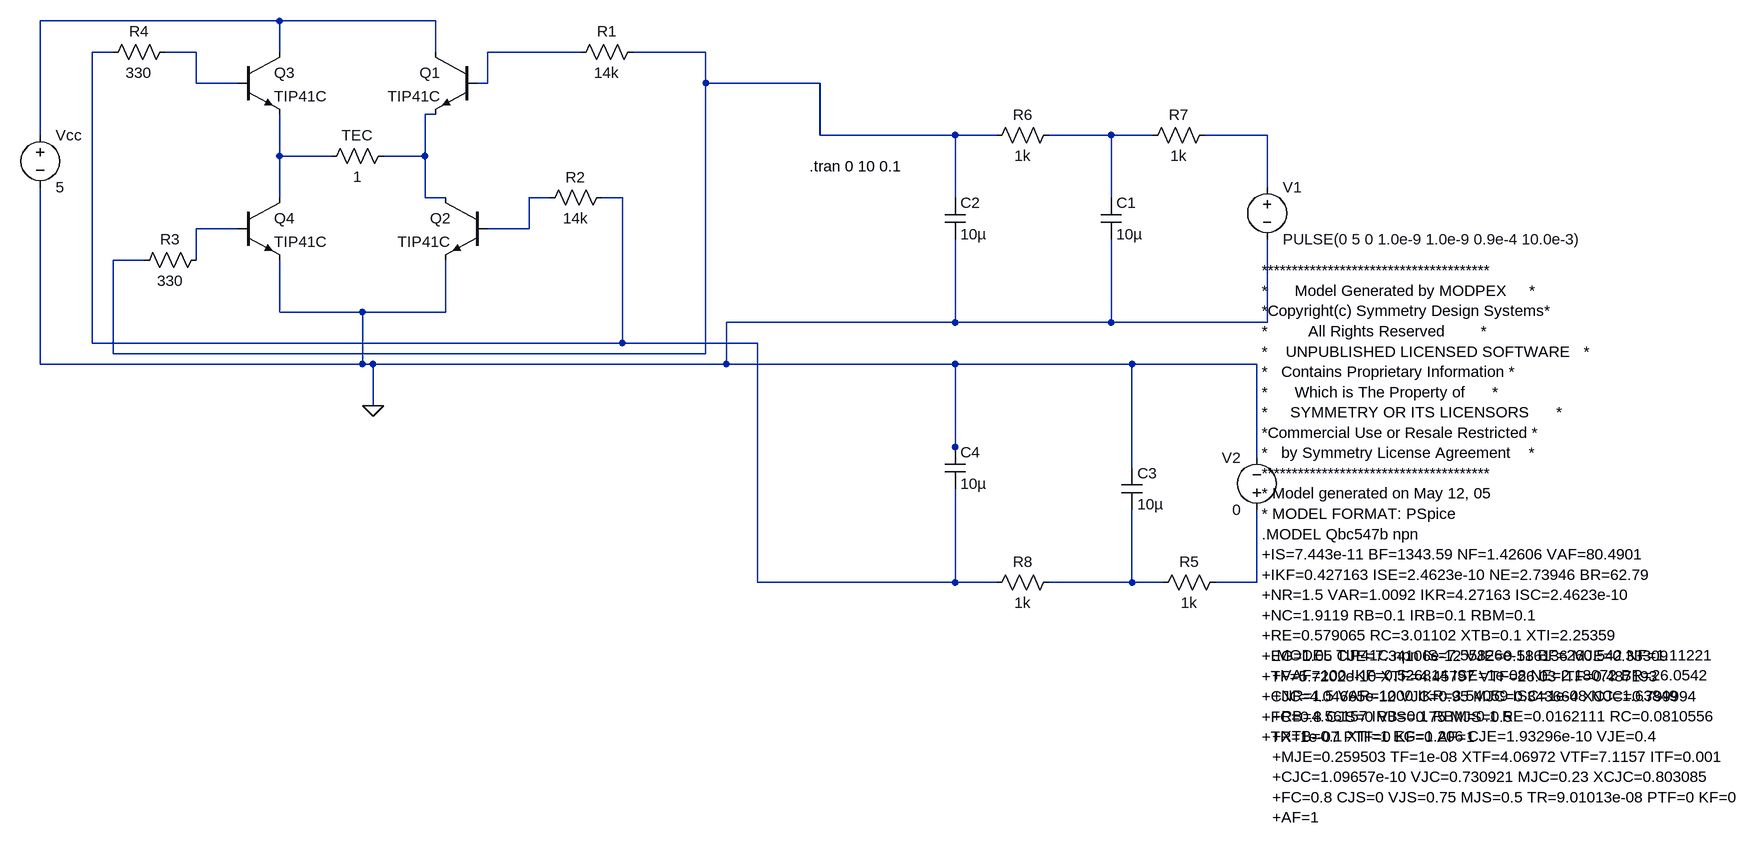
[diagram p0: schematic H-bridge-Darlington withPWM.asc]
H-bridge-Darlington withPWM.asc, the LTspice schematic file:
Version 4
SHEET 1 1956 1104
WIRE -288 -64 -656 -64
WIRE -48 -64 -288 -64
WIRE -544 -16 -576 -16
WIRE -416 -16 -464 -16
WIRE -288 -16 -288 -64
WIRE -48 -16 -48 -64
WIRE 176 -16 32 -16
WIRE 368 -16 256 -16
WIRE -416 32 -416 -16
WIRE -352 32 -416 32
WIRE 32 32 32 -16
WIRE 32 32 16 32
WIRE 368 32 368 -16
WIRE 544 32 368 32
WIRE -48 80 -64 80
WIRE -656 112 -656 -64
WIRE 544 112 544 32
WIRE 752 112 544 112
WIRE 816 112 752 112
WIRE 992 112 896 112
WIRE 1056 112 992 112
WIRE 1232 112 1136 112
WIRE -288 144 -288 80
WIRE -208 144 -288 144
WIRE -64 144 -64 80
WIRE -64 144 -128 144
WIRE 1232 192 1232 112
WIRE -288 208 -288 144
WIRE -64 208 -64 144
WIRE -32 208 -64 208
WIRE 128 208 96 208
WIRE 240 208 208 208
WIRE 752 208 752 112
WIRE 992 208 992 112
WIRE -352 256 -416 256
WIRE 96 256 96 208
WIRE 96 256 32 256
WIRE -496 304 -544 304
WIRE -416 304 -416 256
WIRE -288 384 -288 304
WIRE -160 384 -288 384
WIRE -32 384 -32 304
WIRE -32 384 -160 384
WIRE 752 400 752 272
WIRE 752 400 400 400
WIRE 992 400 992 272
WIRE 992 400 752 400
WIRE 1232 400 1232 272
WIRE 1232 400 992 400
WIRE -576 432 -576 -16
WIRE 240 432 240 208
WIRE 240 432 -576 432
WIRE 448 432 240 432
WIRE -544 448 -544 304
WIRE 368 448 368 32
WIRE 368 448 -544 448
WIRE -656 464 -656 192
WIRE -160 464 -160 384
WIRE -160 464 -656 464
WIRE -144 464 -160 464
WIRE 400 464 400 400
WIRE 400 464 -144 464
WIRE 752 464 400 464
WIRE 1024 464 752 464
WIRE 1216 464 1024 464
WIRE -144 528 -144 464
WIRE 752 592 752 464
WIRE 752 608 752 592
WIRE 1216 608 1216 464
WIRE 1024 624 1024 464
WIRE 448 800 448 432
WIRE 752 800 752 656
WIRE 752 800 448 800
WIRE 816 800 752 800
WIRE 1024 800 1024 688
WIRE 1024 800 896 800
WIRE 1072 800 1024 800
WIRE 1216 800 1216 688
WIRE 1216 800 1152 800
FLAG -144 528 0
SYMBOL npn 16 -16 M0
SYMATTR InstName Q1
SYMATTR Value TIP41C
SYMBOL npn 32 208 M0
SYMATTR InstName Q2
SYMATTR Value TIP41C
SYMBOL npn -352 -16 R0
SYMATTR InstName Q3
SYMATTR Value TIP41C
SYMBOL npn -352 208 R0
SYMATTR InstName Q4
SYMATTR Value TIP41C
SYMBOL res -112 128 R90
WINDOW 0 0 56 VBottom 2
WINDOW 3 32 56 VTop 2
SYMATTR InstName TEC
SYMATTR Value 1
SYMBOL voltage -656 96 R0
SYMATTR InstName Vcc
SYMATTR Value 5
SYMBOL res -400 288 R90
WINDOW 0 0 56 VBottom 2
WINDOW 3 32 56 VTop 2
SYMATTR InstName R3
SYMATTR Value 330
SYMBOL res 272 -32 R90
WINDOW 0 0 56 VBottom 2
WINDOW 3 32 56 VTop 2
SYMATTR InstName R1
SYMATTR Value 14k
SYMBOL res 224 192 R90
WINDOW 0 0 56 VBottom 2
WINDOW 3 32 56 VTop 2
SYMATTR InstName R2
SYMATTR Value 14k
SYMBOL res -448 -32 R90
WINDOW 0 0 56 VBottom 2
WINDOW 3 32 56 VTop 2
SYMATTR InstName R4
SYMATTR Value 330
SYMBOL res 912 96 R90
WINDOW 0 0 56 VBottom 2
WINDOW 3 32 56 VTop 2
SYMATTR InstName R6
SYMATTR Value 1k
SYMBOL res 1152 96 R90
WINDOW 0 0 56 VBottom 2
WINDOW 3 32 56 VTop 2
SYMATTR InstName R7
SYMATTR Value 1k
SYMBOL cap 976 208 R0
SYMATTR InstName C1
SYMATTR Value 10µ
SYMBOL cap 736 208 R0
SYMATTR InstName C2
SYMATTR Value 10µ
SYMBOL voltage 1232 176 R0
SYMATTR InstName V1
SYMATTR Value PULSE(0 5 0 1.0e-9 1.0e-9 0.9e-4 10.0e-3)
SYMBOL res 1168 784 R90
WINDOW 0 0 56 VBottom 2
WINDOW 3 32 56 VTop 2
SYMATTR InstName R5
SYMATTR Value 1k
SYMBOL res 912 784 R90
WINDOW 0 0 56 VBottom 2
WINDOW 3 32 56 VTop 2
SYMATTR InstName R8
SYMATTR Value 1k
SYMBOL voltage 1216 704 R180
WINDOW 0 24 96 Left 2
WINDOW 3 24 16 Left 2
SYMATTR InstName V2
SYMATTR Value 0
SYMBOL cap 1008 624 R0
SYMATTR InstName C3
SYMATTR Value 10µ
SYMBOL cap 736 592 R0
SYMATTR InstName C4
SYMATTR Value 10µ
TEXT 528 160 Left 2 !.tran 0 10 0.1
TEXT 1224 320 Left 2 !**************************************\n*      Model Generated by MODPEX     *\n*Copyright(c) Symmetry Design Systems*\n*         All Rights Reserved        *\n*    UNPUBLISHED LICENSED SOFTWARE   *\n*   Contains Proprietary Information *\n*      Which is The Property of      *\n*     SYMMETRY OR ITS LICENSORS      *\n*Commercial Use or Resale Restricted *\n*   by Symmetry License Agreement    *\n**************************************\n* Model generated on May 12, 05\n* MODEL FORMAT: PSpice\n.MODEL Qbc547b npn\n+IS=7.443e-11 BF=1343.59 NF=1.42606 VAF=80.4901\n+IKF=0.427163 ISE=2.4623e-10 NE=2.73946 BR=62.79\n+NR=1.5 VAR=1.0092 IKR=4.27163 ISC=2.4623e-10\n+NC=1.9119 RB=0.1 IRB=0.1 RBM=0.1\n+RE=0.579065 RC=3.01102 XTB=0.1 XTI=2.25359\n+EG=1.05 CJE=7.34106e-12 VJE=0.586136 MJE=0.33309\n+TF=5.7202e-10 XTF=4.45797 VTF=26.03 ITF=0.487193\n+CJC=4.04665e-12 VJC=0.95 MJC=0.343664 XCJC=0.799994\n+FC=0.8 CJS=0 VJS=0.75 MJS=0.5\n+TR=1e-07 PTF=0 KF=0 AF=1
TEXT 1240 912 Left 2 !.MODEL TIP41C npn IS=7.55826e-11 BF=260.542 NF=1.11221\n+VAF=100 IKF=0.526814 ISE=1e-08 NE=2.18072 BR=26.0542\n+NR=1.5 VAR=1000 IKR=3.54059 ISC=1e-08 NC=1.63849\n+RB=4.56157 IRB=0.1 RBM=0.1 RE=0.0162111 RC=0.0810556\n+XTB=0.1 XTI=1 EG=1.206 CJE=1.93296e-10 VJE=0.4\n+MJE=0.259503 TF=1e-08 XTF=4.06972 VTF=7.1157 ITF=0.001\n+CJC=1.09657e-10 VJC=0.730921 MJC=0.23 XCJC=0.803085\n+FC=0.8 CJS=0 VJS=0.75 MJS=0.5 TR=9.01013e-08 PTF=0 KF=0\n+AF=1

The netlist it stands for:
* H-bridge-Darlington withPWM.asc
Q1 N001 N004 N006 0 TIP41C
Q2 N006 N010 0 0 TIP41C
Q3 N001 N003 N009 0 TIP41C
Q4 N009 N011 0 0 TIP41C
R§TEC N006 N009 1
Vcc N001 0 5
R3 N011 N005 330
R1 N005 N004 14k
R2 N002 N010 14k
R4 N003 N002 330
R6 N007 N005 1k
R7 N008 N007 1k
C1 N007 0 10µ
C2 N005 0 10µ
V1 N008 0 PULSE(0 5 0 1.0e-9 1.0e-9 0.9e-4 10.0e-3)
R5 N013 N012 1k
R8 N012 N002 1k
V2 N013 0 0
C3 0 N012 10µ
C4 0 N002 10µ
.model NPN NPN
.model PNP PNP
.lib standard.bjt
.tran 0 10 0.1
**************************************
*      Model Generated by MODPEX     *
*Copyright(c) Symmetry Design Systems*
*         All Rights Reserved        *
*    UNPUBLISHED LICENSED SOFTWARE   *
*   Contains Proprietary Information *
*      Which is The Property of      *
*     SYMMETRY OR ITS LICENSORS      *
*Commercial Use or Resale Restricted *
*   by Symmetry License Agreement    *
**************************************
* Model generated on May 12, 05
* MODEL FORMAT: PSpice
.MODEL Qbc547b npn
+IS=7.443e-11 BF=1343.59 NF=1.42606 VAF=80.4901
+IKF=0.427163 ISE=2.4623e-10 NE=2.73946 BR=62.79
+NR=1.5 VAR=1.0092 IKR=4.27163 ISC=2.4623e-10
+NC=1.9119 RB=0.1 IRB=0.1 RBM=0.1
+RE=0.579065 RC=3.01102 XTB=0.1 XTI=2.25359
+EG=1.05 CJE=7.34106e-12 VJE=0.586136 MJE=0.33309
+TF=5.7202e-10 XTF=4.45797 VTF=26.03 ITF=0.487193
+CJC=4.04665e-12 VJC=0.95 MJC=0.343664 XCJC=0.799994
+FC=0.8 CJS=0 VJS=0.75 MJS=0.5
+TR=1e-07 PTF=0 KF=0 AF=1
.MODEL TIP41C npn IS=7.55826e-11 BF=260.542 NF=1.11221
+VAF=100 IKF=0.526814 ISE=1e-08 NE=2.18072 BR=26.0542
+NR=1.5 VAR=1000 IKR=3.54059 ISC=1e-08 NC=1.63849
+RB=4.56157 IRB=0.1 RBM=0.1 RE=0.0162111 RC=0.0810556
+XTB=0.1 XTI=1 EG=1.206 CJE=1.93296e-10 VJE=0.4
+MJE=0.259503 TF=1e-08 XTF=4.06972 VTF=7.1157 ITF=0.001
+CJC=1.09657e-10 VJC=0.730921 MJC=0.23 XCJC=0.803085
+FC=0.8 CJS=0 VJS=0.75 MJS=0.5 TR=9.01013e-08 PTF=0 KF=0
+AF=1
.backanno
.end